# EasyEDA schematic TRC_ESP8266.json
TITLE: Temperature Sensor and Relay Control ESP8266; REV: 3.5; Date: 2023-07-05; Sheet: 1/1; Company: University of Arizona
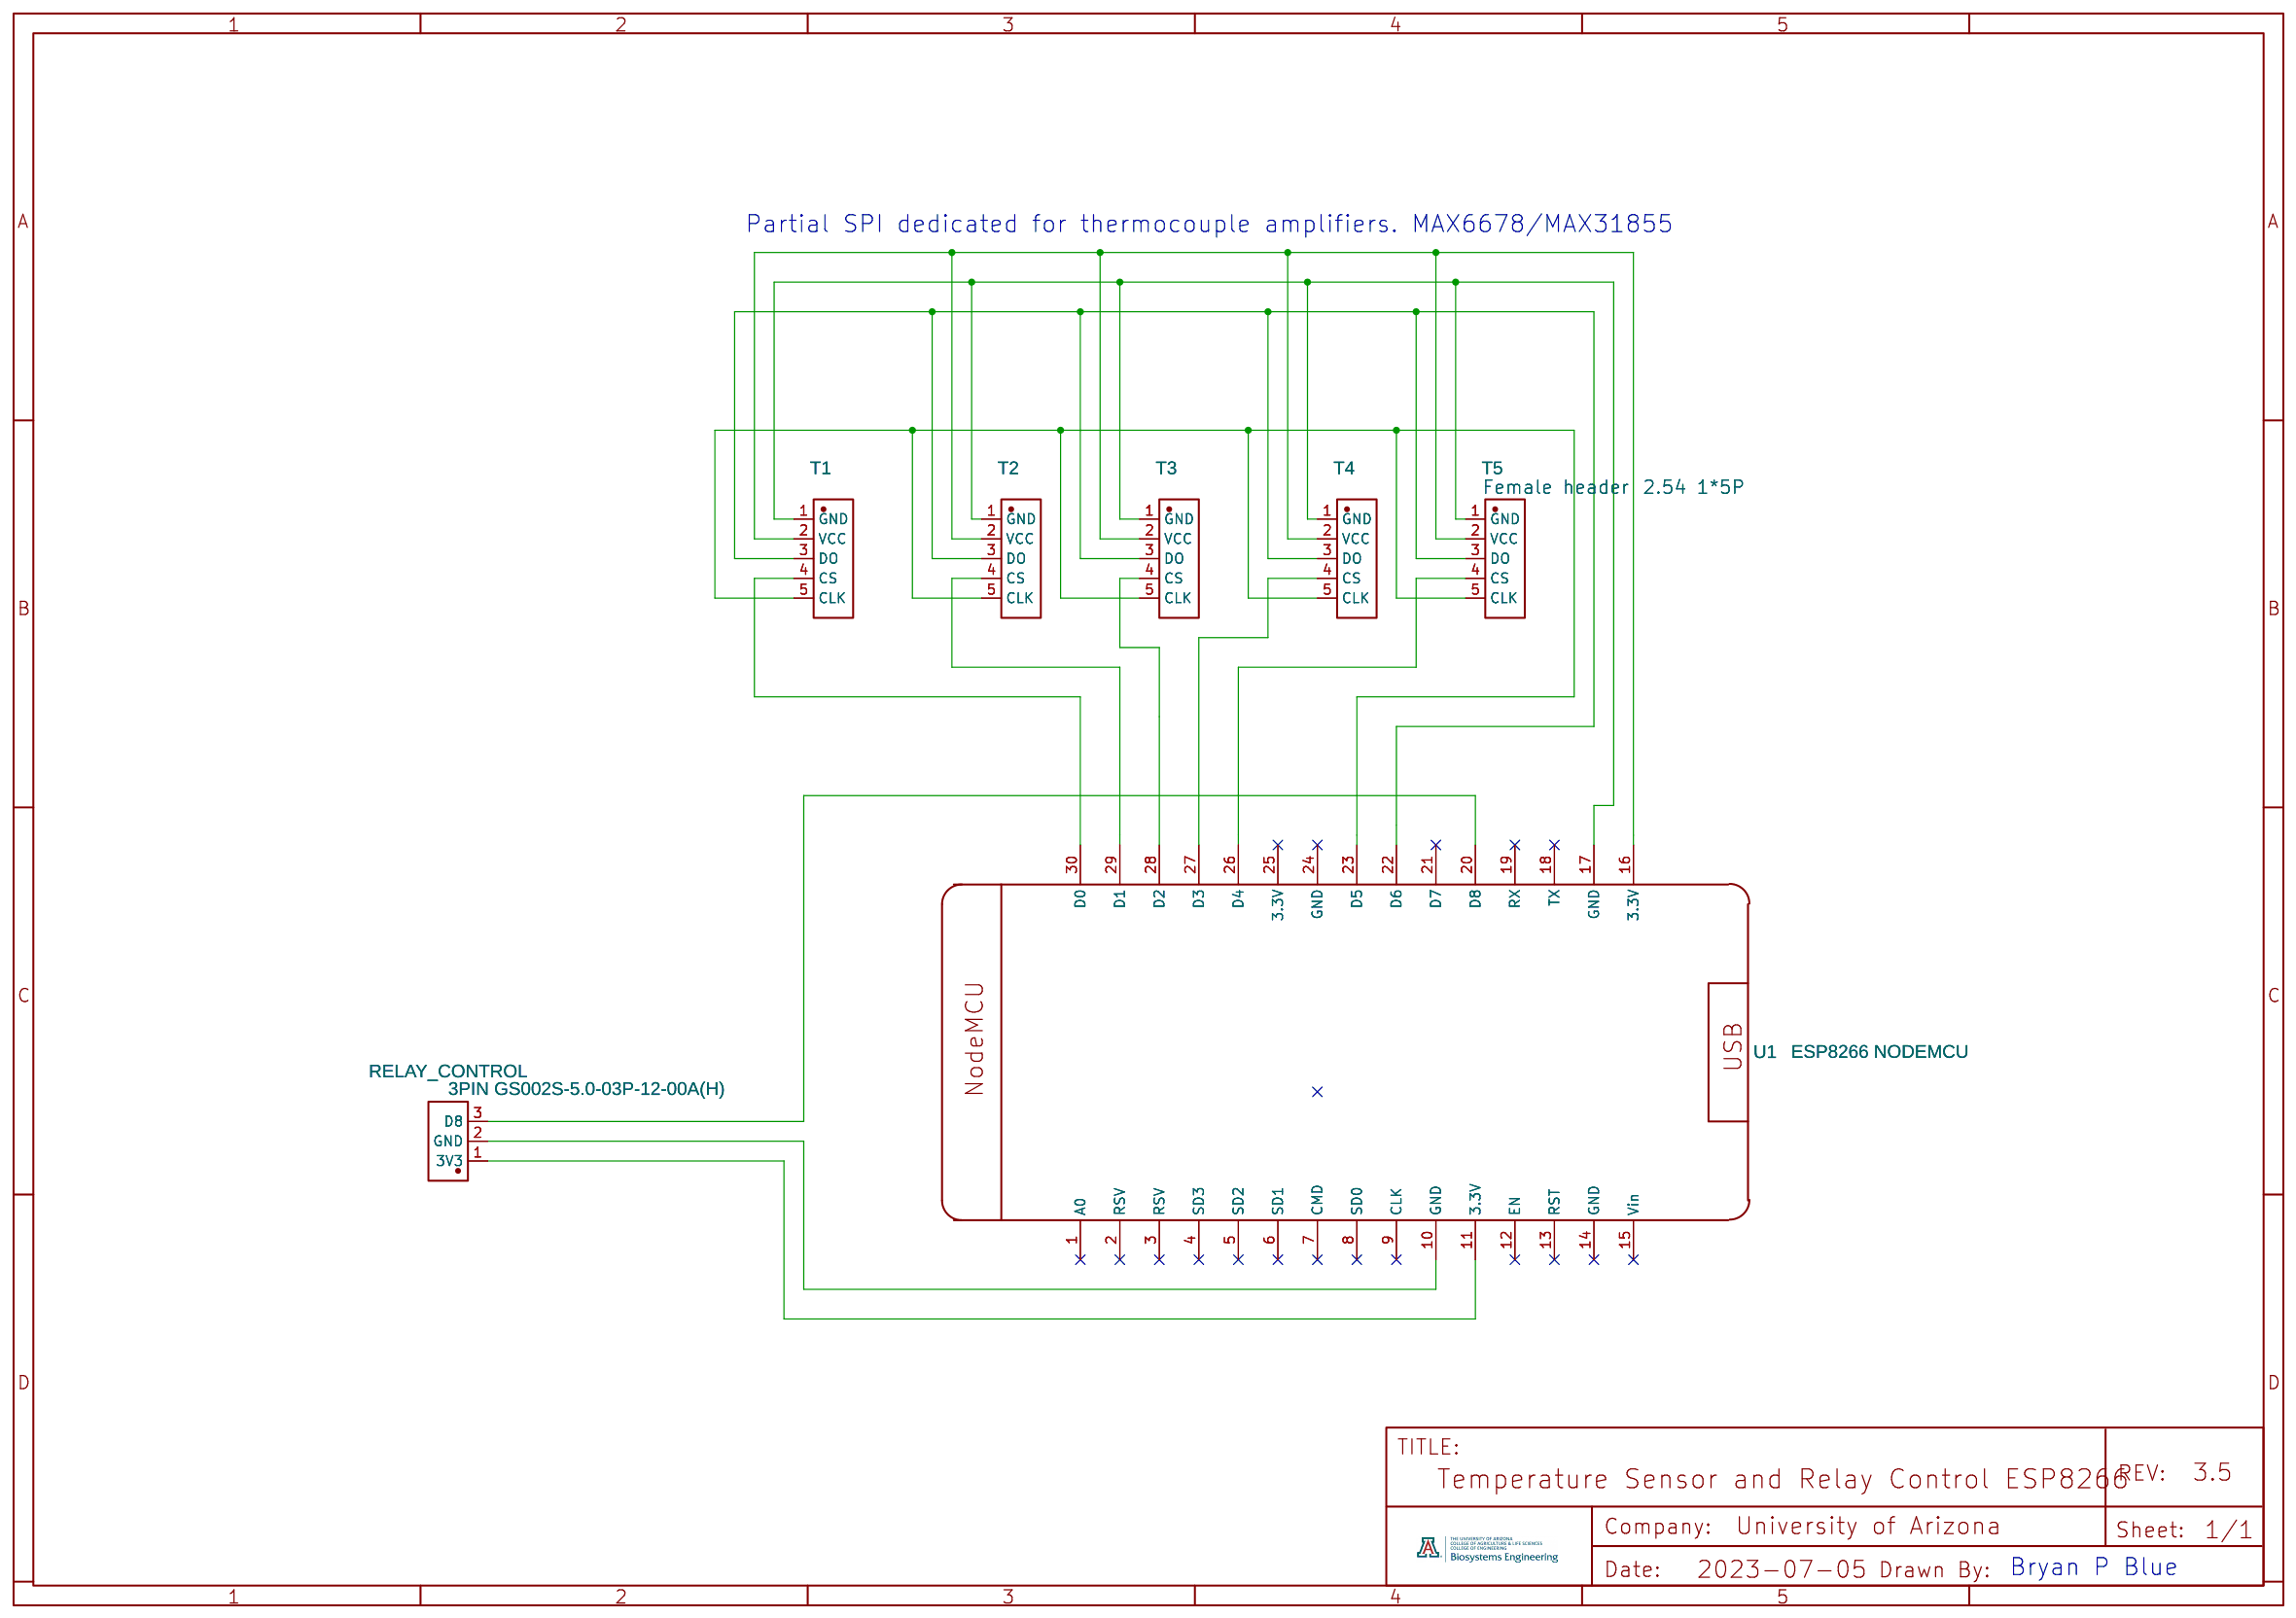
[diagram p0: schematic sheet]

## Parts
RELAY_CONTROL  3PIN GS002S-5.0-03P-12-00A(H)  [CONN-TH_GOOSVN_GS002S-5.0-03P]
T1  Female header　2.54 1*5Ｐ  [HDR-TH_5P-P2.54-V-F-B]
T2  Female header　2.54 1*5Ｐ  [HDR-TH_5P-P2.54-V-F-B]
T3  Female header　2.54 1*5Ｐ  [HDR-TH_5P-P2.54-V-F-B]
T4  Female header　2.54 1*5Ｐ  [HDR-TH_5P-P2.54-V-F-B]
T5  Female header　2.54 1*5Ｐ  [HDR-TH_5P-P2.54-V-F-B]
U1  ESP8266 NODEMCU  [NODEMCU ESP8266]

## Library data of the parts
RELAY_CONTROL = 3PIN клеммник винтовой GS002S-5.0-03P-12-00A(H): Supplier Part: C5142592; Manufacturer: GOOSVN(高胜); Manufacturer Part: GS002S-5.0-03P-12-00A(H); Contributor: alxm
T1-T5 = Female header　2.54 1*5Ｐ: Supplier Part: C46341; Supplier: LCSC; Manufacturer: ReliaPro; JLCPCB Part Class: Extended Part
U1 = NODEMCU COPY: Contributor: nrn.nitb; Package Display: No

## Nets
Net-(RELAY_CONTROL-1): RELAY_CONTROL.1(3V3) U1.11(3.3V)
Net-(RELAY_CONTROL-2): RELAY_CONTROL.2(GND) U1.10(GND)
Net-(RELAY_CONTROL-3): RELAY_CONTROL.3(D8) U1.20(D8)
Net-(T1-1): T1.1(GND) T2.1(GND) T3.1(GND) T4.1(GND) T5.1(GND) U1.17(GND)
Net-(T1-2): T1.2(VCC) T2.2(VCC) T3.2(VCC) T4.2(VCC) T5.2(VCC) U1.16(3.3V)
Net-(T1-3): T1.3(DO) T2.3(DO) T3.3(DO) T4.3(DO) T5.3(DO) U1.22(D6)
Net-(T1-4): T1.4(CS) U1.30(D0)
Net-(T1-5): T1.5(CLK) T2.5(CLK) T3.5(CLK) T4.5(CLK) T5.5(CLK) U1.23(D5)
Net-(T2-4): T2.4(CS) U1.29(D1)
Net-(T3-4): T3.4(CS) U1.28(D2)
Net-(T4-4): T4.4(CS) U1.27(D3)
Net-(T5-4): T5.4(CS) U1.26(D4)

Not connected (* = marked no-connect by the designer): U1 1(A0)* 2(RSV)* 3(RSV)* 4(SD3)* 5(SD2)* 6(SD1)* 7(CMD)* 8(SD0)* 9(CLK)* 12(EN)* 13(RST)* 14(GND)* 15(Vin)* 18(TX)* 19(RX)* 21(D7)* 24(GND)* 25(3.3V)*

## Notes on the sheet
- Partial SPI dedicated for thermocouple amplifiers. MAX6678/MAX31855
- Bryan P Blue
